# EAGLE design Fuente_12_9_5 (EAGLE 5.08)
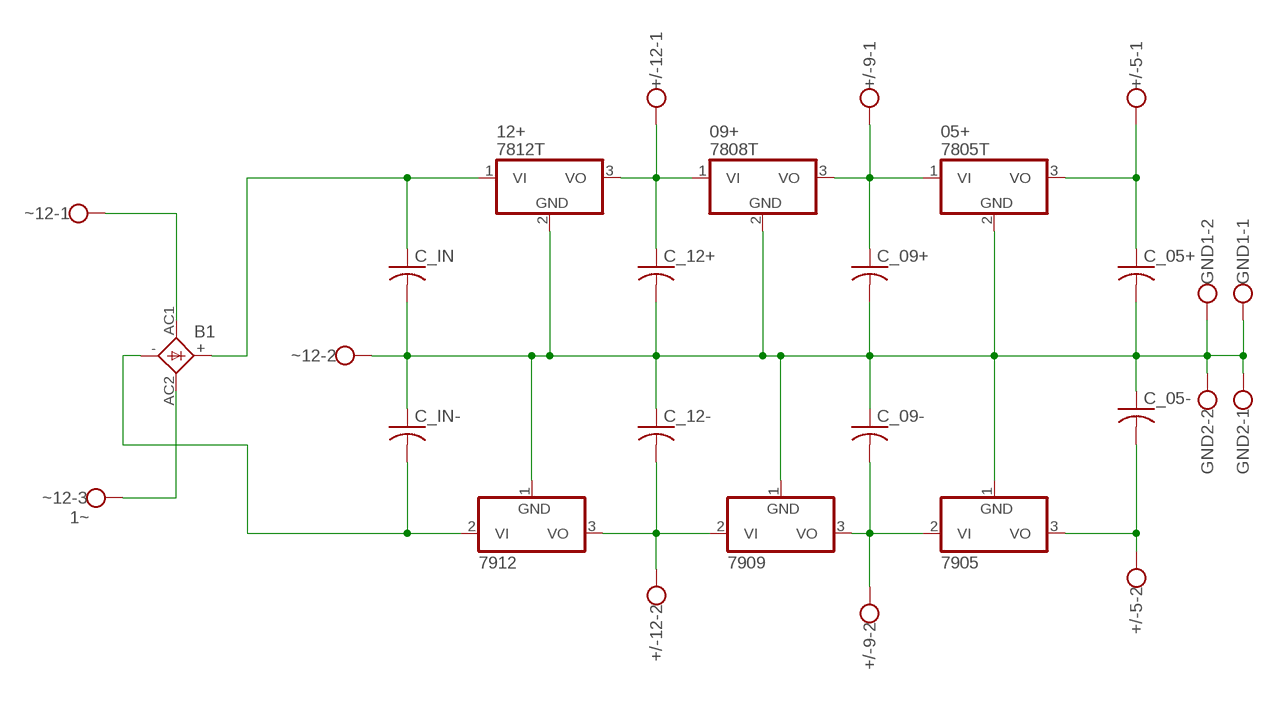
[diagram p0: schematic, sheet 1]

## Parts
05+  7805T  [TO220H]
09+  7808T  [TO220H]
12+  7812T  [TO220H]
7905  7905T  [TO220H]
7909  7908T  [TO220H]
7912  7912T  [TO220H]
+/-5  W237-02P  [W237-132]
+/-9  W237-02P  [W237-132]
+/-12  W237-02P  [W237-132]
B1  FB15  [FB15]
C_05+  C-US025-030X050  [C025-030X050]
C_05-  C-US025-030X050  [C025-030X050]
C_09+  C-US025-030X050  [C025-030X050]
C_09-  C-US025-030X050  [C025-030X050]
C_12+  C-US025-030X050  [C025-030X050]
C_12-  C-US025-030X050  [C025-030X050]
C_IN  C-US050-030X075  [C050-030X075]
C_IN-  C-US050-030X075  [C050-030X075]
GND1  W237-02P  [W237-132]
GND2  W237-02P  [W237-132]
~12  1~  W237-03P  [W237-133]

## Nets
N$1: B1.AC1 ~12.1
N$2: B1.AC2 ~12.3
N$3: 12+.1(VI) B1.+ C_IN.1
N$4: 7912.2(VI) B1.- C_IN-.2
N$5: 7905.3(VO) +/-5.2 C_05-.2
N$6: 09+.1(VI) 12+.3(VO) +/-12.1 C_12+.1
N$7: 7909.2(VI) 7912.3(VO) +/-12.2 C_12-.2
N$8: 05+.1(VI) 09+.3(VO) +/-9.1 C_09+.1
N$9: 7905.2(VI) 7909.3(VO) +/-9.2 C_09-.2
N$10: 05+.3(VO) +/-5.1 C_05+.1
TIERRA: 05+.2(GND) 09+.2(GND) 12+.2(GND) 7905.1(GND) 7909.1(GND) 7912.1(GND) C_05+.2 C_05-.1 C_09+.2 C_09-.1 C_12+.2 C_12-.1 C_IN-.1 C_IN.2 GND1.1 GND1.2 GND2.1 GND2.2 ~12.2

## Library data of the parts
05+ 09+ 12+ = linear:78*: Positive VOLTAGE REGULATOR Source: http://cache.national.com/ds/LM/LM78L05.pdf http://www.fairchildsemi.com/ds/LM/LM7805.pdf
7905 7909 7912 = linear:79*: Negative VOLTAGE REGULATOR
+/-5 +/-9 +/-12 GND1 GND2 = con-wago-508:W237-02P: WAGO SREW CLAMP
B1 = rectifier:FB15: FAGOR RECTIFIER grid 3 x 5 mm
C_05+ C_05- C_09+ C_09- C_12+ C_12- C_IN C_IN- = rcl:C-US: CAPACITOR, American symbol
~12 = con-wago-508:W237-03P: WAGO SREW CLAMP

## Board
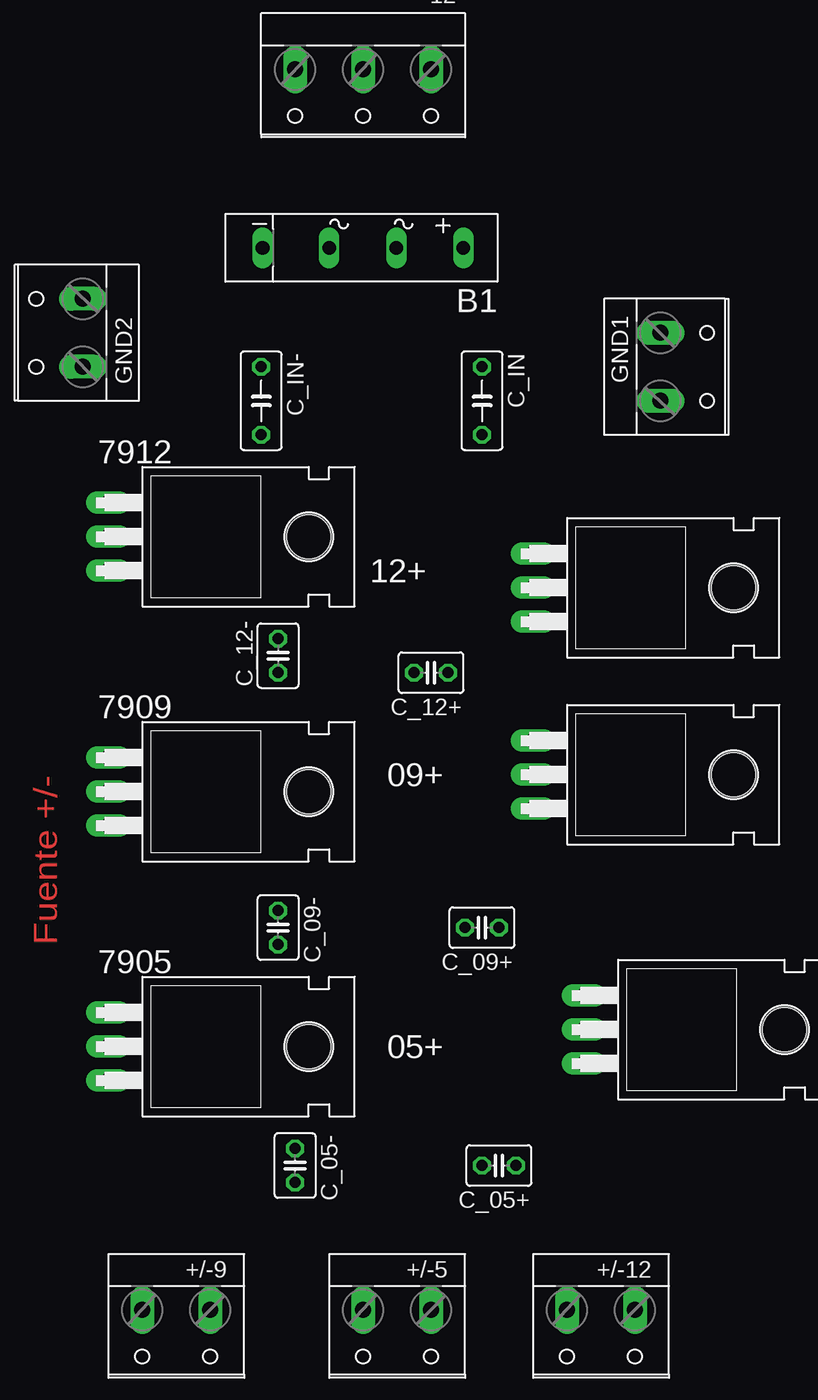
[diagram p1: board, top side]
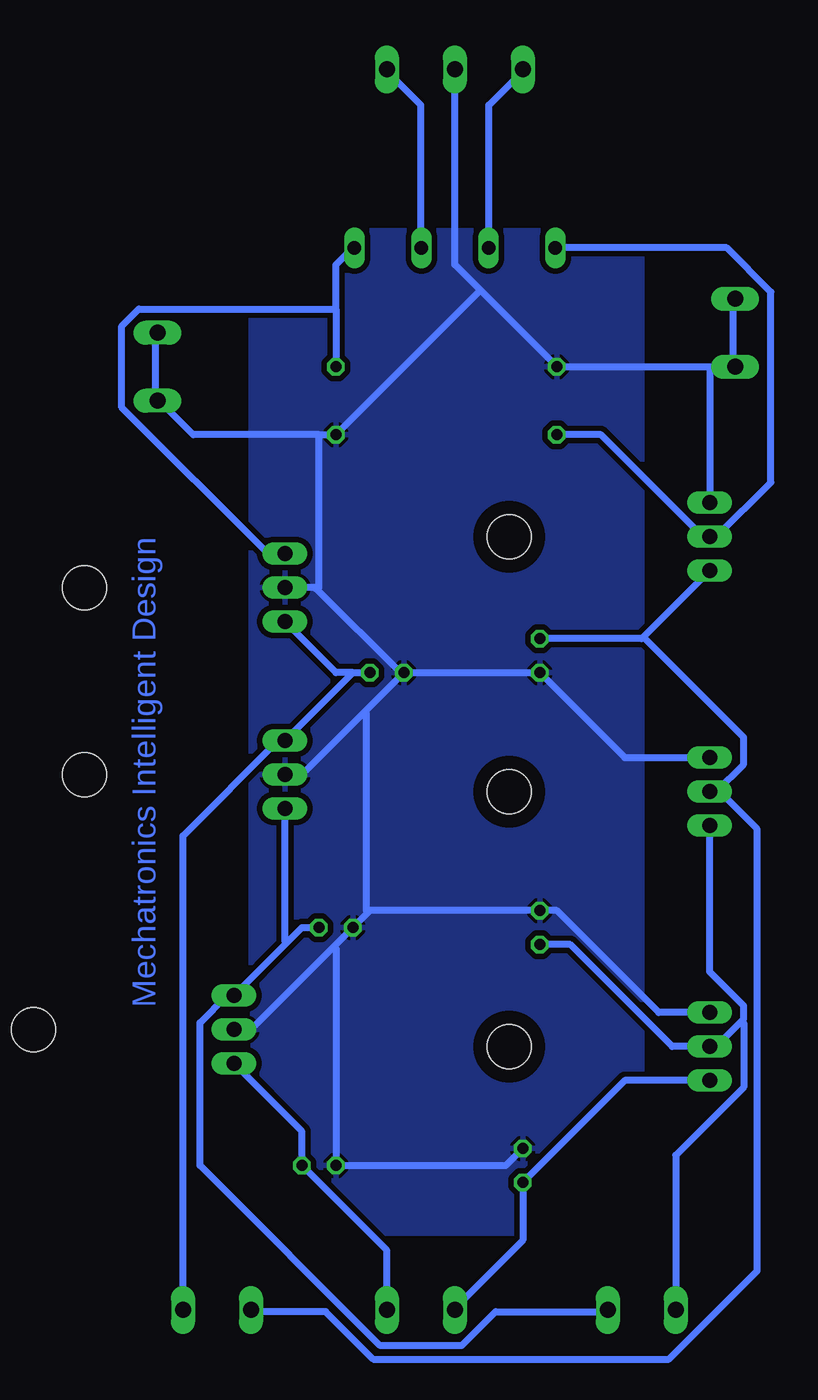
[diagram p2: board, bottom side, seen from below]

No outline drawn. Coordinates in mm, seen from the top.
Copper layers (1*16): Top 0.035mm / dielectric 1.5mm / Bottom 0.035mm
Design rules "16_clear_20_line *": minimum track width 20mil, minimum drill 24mil, track to track 16mil, track to pad 16mil, pad to pad 16mil, via to via 16mil, smd to smd 8mil, copper to edge 40mil, drill to drill 8mil, minimum pad ring 10mil, minimum via ring 8mil, stop-mask expansion 4mil, vias tented up to drill 0mil, thermal gap 10mil

### Footprints (pad centres in the part's own frame; a part is rotated, then mirrored left to right if it is on the bottom)
TO220H = drill 1.118 long: 1 -2.54,-10.16; 2 0,-10.16; 3 2.54,-10.16 | hole 3.302: 0,4.826
W237-132 = drill 1.194 long: 1 -2.54,-0.635; 2 2.54,-0.635
FB15 = drill 1.016 long: + -7.5,0; - 7.511,0; AC1 -2.496,0; AC2 2.533,0
C025-030X050 = drill 0.813 octagon: 1 -1.27,0; 2 1.27,0
C050-030X075 = drill 0.813 octagon: 1 -2.54,0; 2 2.54,0
W237-133 = drill 1.194 long: 1 -5.08,-0.635; 2 0,-0.635; 3 5.08,-0.635

### Placement (x,y rotation side)
05+  57.15,-7.62 270 top
09+  53.34,11.43 270 top
12+  53.34,25.4 270 top
7905  21.59,-8.89 270 top
7909  21.59,10.16 270 top
7912  21.59,29.21 270 top
+/-5  33.02,-29.21 180 top
+/-9  16.51,-29.21 180 top
+/-12  48.26,-29.21 180 top
B1  30.48,50.8 180 top
C_05+  40.64,-17.78 180 top
C_05-  25.4,-17.78 270 top
C_09+  39.37,0 180 top
C_09-  24.13,0 270 top
C_12+  35.56,19.05 180 top
C_12-  24.13,20.32 90 top
C_IN  39.37,39.37 270 top
C_IN-  22.86,39.37 270 top
GND1  53.34,41.91 270 top
GND2  8.89,44.45 90 top
~12  30.48,63.5 180 top

### Tracks (layer width: path | path; a pad name or v marks a point on that pad's centre or on a via)
N$1
  Bottom 0.508: B1.AC1 33.02,50.8 33.02,61.47 35.56,64.01 ~12.1
N$2
  Bottom 0.508: B1.AC2 27.94,61.47 25.4,64.01 ~12.3
N$3
  Bottom 0.508: 39.37,46.23 39.37,49.53 38.1,50.8 B1.+ | 39.37,46.23 C_IN.1 | 12+.1 44.45,27.94 55.37,38.86 55.37,44.96 54.1,46.23 39.37,46.23
N$4
  Bottom 0.508: C_IN-.2 19.56,36.83 11.94,29.21 7912.2 10.92,29.21 6.86,33.27 6.86,47.5 10.16,50.8 B1.-
N$5
  Bottom 0.508: +/-5.2 30.48,-28.45 25.4,-23.37 C_05-.2 17.78,-11.43 7905.3
N$6
  Bottom 0.508: 38.1,19.05 39.37,19.05 12+.3 | 38.1,19.05 C_12+.1 | 38.1,19.05 09+.1 43.69,13.97 50.8,6.86 +/-12.1
N$7
  Bottom 0.508: C_12-.2 16.51,21.59 16.38,21.72 | 16.38,21.72 7912.3 | 16.38,21.72 8.89,14.22 8.89,12.19 10.92,10.16 7909.2 10.67,10.16 7.87,7.37 7.87,-25.65 14.48,-32.26 36.58,-32.26 40.13,-28.7 45.72,-28.7 +/-12.2
N$8
  Bottom 0.508: C_09+.1 41.91,0 43.05,-1.14 | 43.05,-1.14 05+.1 47.5,-5.08 49.53,-7.11 49.53,-17.78 36.07,-31.24 29.97,-31.24 27.43,-28.7 19.05,-28.7 +/-9.1 | 09+.3 43.18,-1.02 43.05,-1.14
N$9
  Bottom 0.508: C_09-.2 21.84,-1.27 14.22,-8.89 7905.2 10.92,-8.89 9.02,-6.99 | 7909.3 11.43,-3.3 8.89,-5.84 8.89,-6.86 9.02,-6.99 | +/-9.2 13.97,-17.02 8.89,-11.94 8.89,-7.11 9.02,-6.99
N$10
  Bottom 0.508: 05+.3 41.91,-15.24 C_05+.1 35.56,-24.13 +/-5.1
TIERRA
  Bottom 0.508: 11.43,41.91 9.65,41.91 | 11.43,41.91 C_IN-.1 28.57,47.62 | 11.43,41.91 7912.1 | 9.65,41.91 9.65,46.99 GND2.2 | 9.65,41.91 GND2.1 | 28.57,47.62 30.48,49.53 ~12.2 | C_05-.1 26.67,-17.78 C_05+.2 39.37,-1.52 39.5,-1.4 | 36.96,1.14 C_09+.2 39.5,-1.4 | 36.96,1.14 36.83,1.27 C_09-.1 22.86,1.27 15.24,-6.35 7905.1 | 05+.2 45.72,-7.62 39.5,-1.4 | 40.64,36.83 50.04,36.83 52.58,39.37 GND1.2 52.83,39.37 52.83,44.45 GND1.1 | 40.64,36.83 C_IN.2 28.57,47.62 | C_12+.2 C_12-.1 17.78,12.7 7909.1 | 09+.2 41.91,11.43 37.21,16.13 | 37.21,16.13 C_12+.2 | 12+.2 40.89,25.4 40.77,25.27 | 40.77,25.27 34.54,19.05 C_12+.2 | 40.64,36.83 40.64,25.4 40.77,25.27 | 36.96,1.14 37.08,1.27 37.08,16 37.21,16.13
  pour Bottom: 16.51,52.07 45.72,52.07 45.72,-22.86 16.51,-22.86

### Text on the board
Top: Fuente +/-
Bottom: Mechatronics Intelligent Design